# EAGLE design IEC-Breakout (EAGLE 9.6.2)
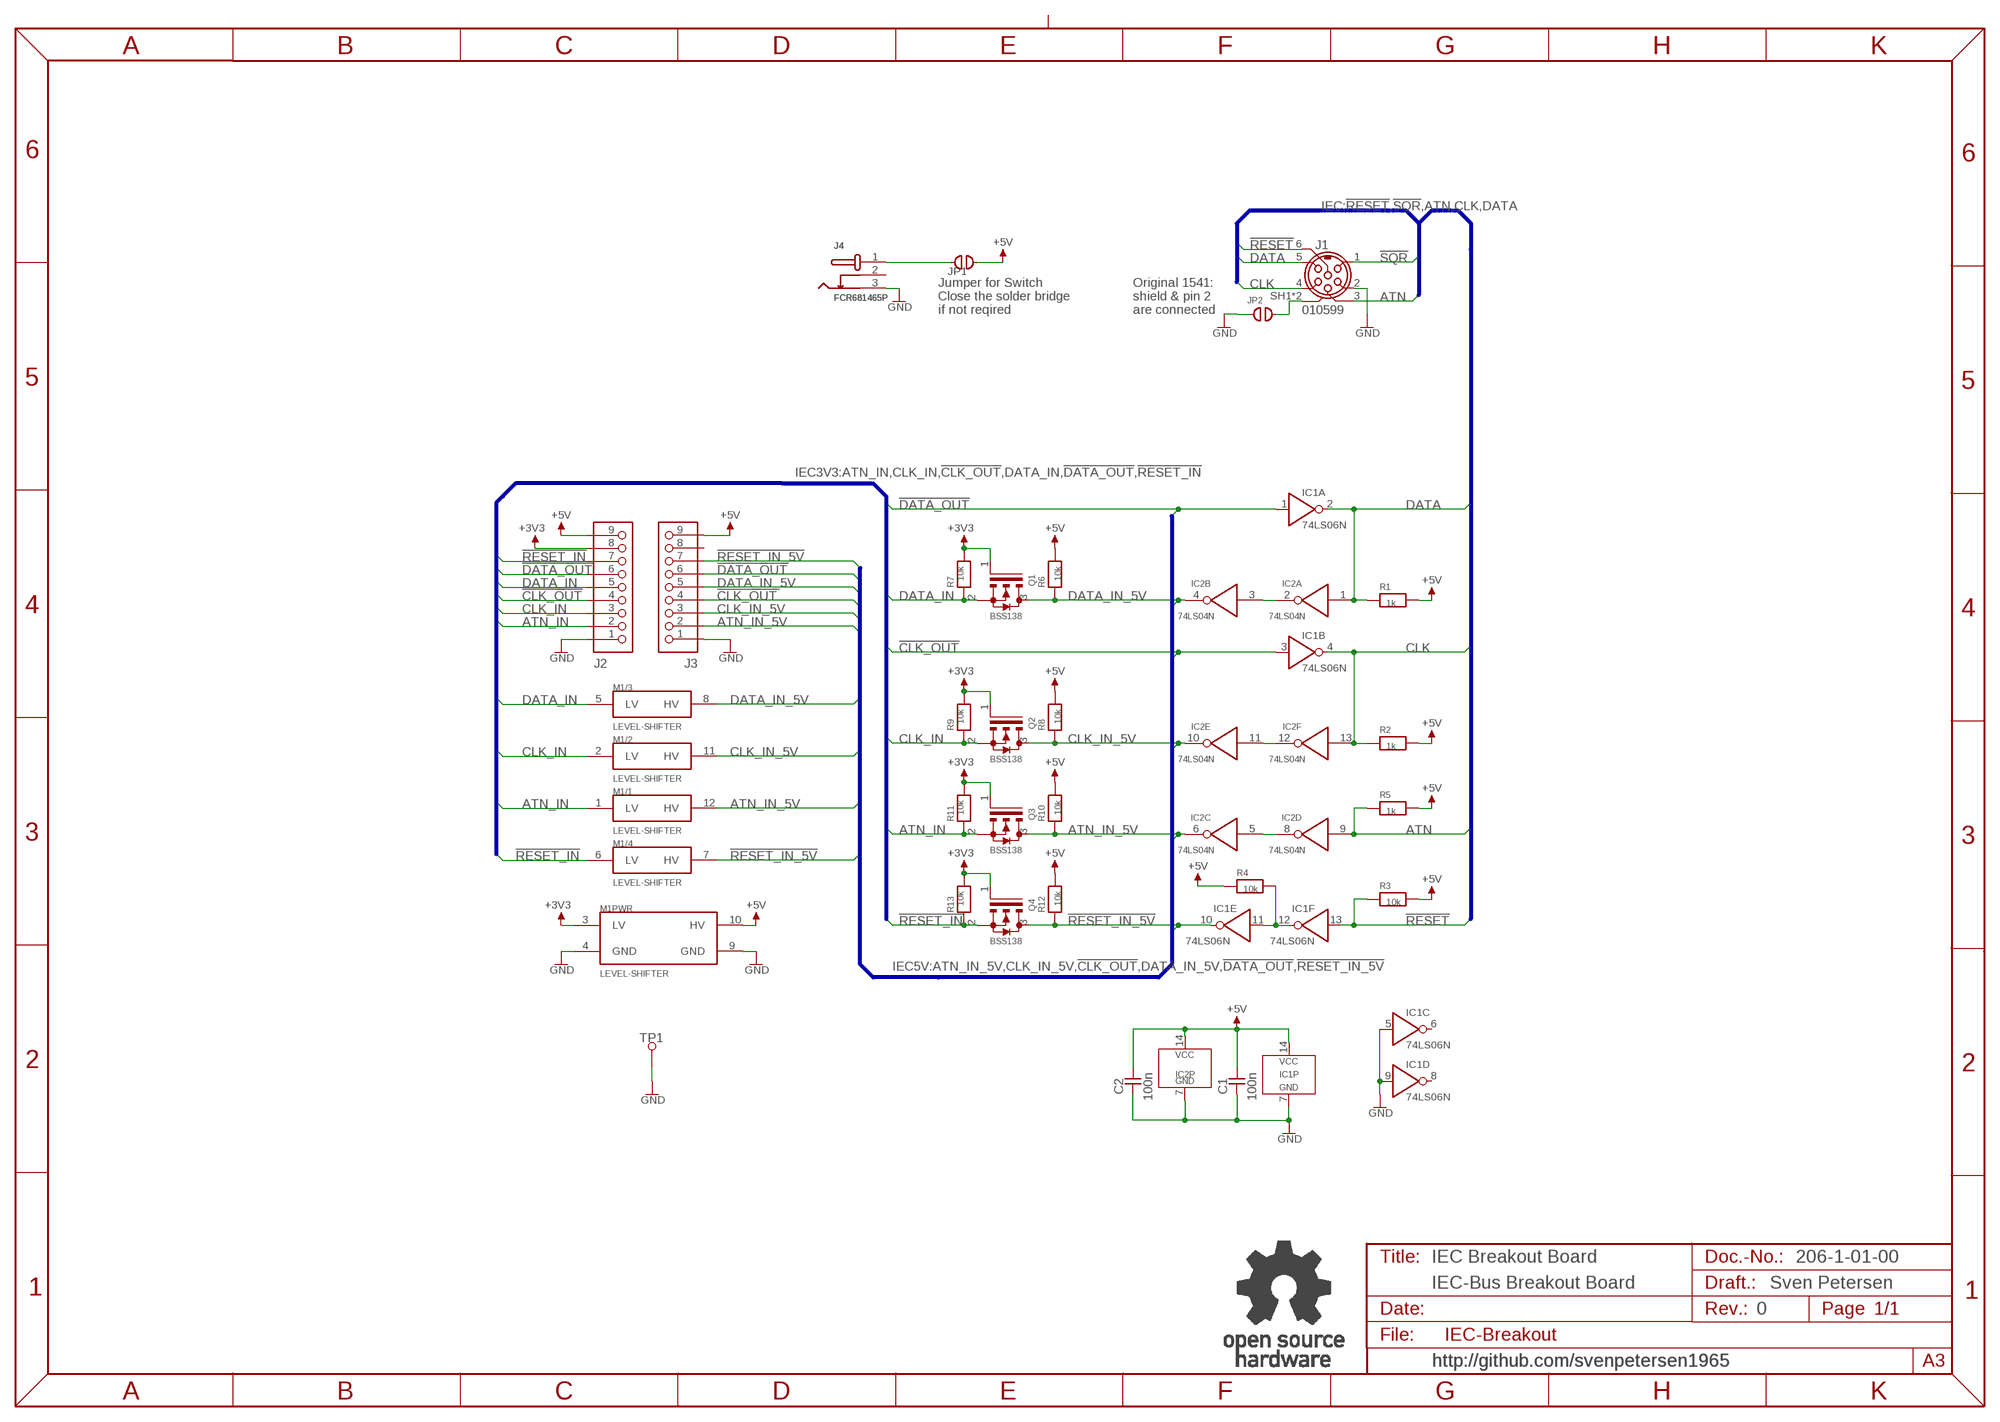
[diagram p0: schematic, sheet 1]

## Parts
C1  100n  CAP01  [C-2,5]
C2  100n  CAP01  [C-2,5]
IC1  74LS06N  7406N  [DIL-14]
IC2  74LS04N  7404N  [DIL-14]
J1  010599  [010599]
J2  PINHD-1X9  [1X09]
J3  PINHD-1X9  [1X09]
J4  FCR681465P  [FCR681465P]
JP1  COMBI_2P  [COMBI-2P]
JP2  OPEN  [CP_OP]
M1  LEVEL-SHIFTER  [L-SHIFTER]
Q1  BSS138  [SOT23]
Q2  BSS138  [SOT23]
Q3  BSS138  [SOT23]
Q4  BSS138  [SOT23]
R1  1k  RES04  [R-10]
R2  1k  RES04  [R-10]
R3  10k  RES04  [R-10]
R4  10k  RES04  [R-10]
R5  1k  RES04  [R-10]
R6  10k  R-0805  [0805]
R7  10k  R-0805  [0805]
R8  10k  R-0805  [0805]
R9  10k  R-0805  [0805]
R10  10k  R-0805  [0805]
R11  10k  R-0805  [0805]
R12  10k  R-0805  [0805]
R13  10k  R-0805  [0805]
TP1  L1,2_R  [1,2MM_R]
U$31  OPEN_SOURCE_HW  [OPENHW]

## Nets
!CLK_OUT: IC1.3(B:I) J2.4 J3.4
!DATA_OUT: IC1.1(A:I) J2.6 J3.6
!RESET: IC1.13(F:I) J1.6 R3.1
!RESET_IN: J2.7 M1.6(/4:LV) Q4.2(S) R13.1
!RESET_IN_5V: IC1.10(E:O) J3.7 M1.7(/4:HV) Q4.3(D) R12.1
!SQR: J1.1
+3V3: J2.8 M1.3(PWR:LV) Q1.1(G) Q2.1(G) Q3.1(G) Q4.1(G) R7.2 R9.2 R11.2 R13.2
+5V: C1.2 C2.2 IC1.14(P:VCC) IC2.14(P:VCC) J2.9 J3.9 JP1.2 M1.10(PWR:HV) R1.2 R2.2 R3.2 R4.1 R5.2 R6.2 R8.2 R10.2 R12.2
ATN: IC2.9(D:I) J1.3 R5.1
ATN_IN: J2.2 M1.1(/1:LV) Q3.2(S) R11.1
ATN_IN_5V: IC2.6(C:O) J3.2 M1.12(/1:HV) Q3.3(D) R10.1
CLK: IC1.4(B:O) IC2.13(F:I) J1.4 R2.1
CLK_IN: J2.3 M1.2(/2:LV) Q2.2(S) R9.1
CLK_IN_5V: IC2.10(E:O) J3.3 M1.11(/2:HV) Q2.3(D) R8.1
DATA: IC1.2(A:O) IC2.1(A:I) J1.5 R1.1
DATA_IN: J2.5 M1.5(/3:LV) Q1.2(S) R7.1
DATA_IN_5V: IC2.4(B:O) J3.5 M1.8(/3:HV) Q1.3(D) R6.1
GND: C1.1 C2.1 IC1.5(C:I) IC1.7(P:GND) IC1.9(D:I) IC2.7(P:GND) J1.2 J2.1 J3.1 J4.3 JP2.1 M1.4(PWR:GND) M1.9(PWR:GND) TP1.1
N$1: J1.SH1(SH) J1.SH2(SH) JP2.2
N$2: IC2.2(A:O) IC2.3(B:I)
N$3: J4.1 JP1.1
N$4: IC2.11(E:I) IC2.12(F:O)
N$5: IC2.5(C:I) IC2.8(D:O)
N$6: IC1.11(E:I) IC1.12(F:O) R4.2
Unconnected: IC1.6(C:O) IC1.8(D:O) J3.8 J4.2

## Buses
IEC:!RESET,!SQR,ATN,CLK,DATA
IEC3V3:ATN_IN,CLK_IN,!CLK_OUT,DATA_IN,!DATA_OUT,!RESET_IN
IEC5V:ATN_IN_5V,CLK_IN_5V,!CLK_OUT,DATA_IN_5V,!DATA_OUT,!RESET_IN_5V

## Notes on the sheet
- Jumper for Switch
  Close the solder bridge
  if not reqired
- Original 1541:
  shield & pin 2 
  are connected
- IEC Breakout Board | 206-1-01-00
- IEC-Bus Breakout Board | Sven Petersen
- 0
- http://github.com/svenpetersen1965 | http://github.com/svenpetersen1965

## Library data of the parts
C1 C2 = DISCRETE:CAP01
IC1 = 74XXsmd:7406
IC2 = 74XX:7404
J1 = Lumberg:010599
J2 J3 = PINHEAD:PINHD-1X9
J4 = Cliff:FCR681465P
JP1 = Cutpad:COMBI_2P
JP2 = Cutpad:OPEN: open Cutpad
M1 = miniModules:LEVEL-SHIFTER
Q1-Q4 = Transistoren:BSS138
R1-R5 = DISCRETE:RES04
R6-R13 = SMD:R-0805
TP1 = Pads:L1,2_R
U$31 = Logo:OPEN_SOURCE_HW

## Board
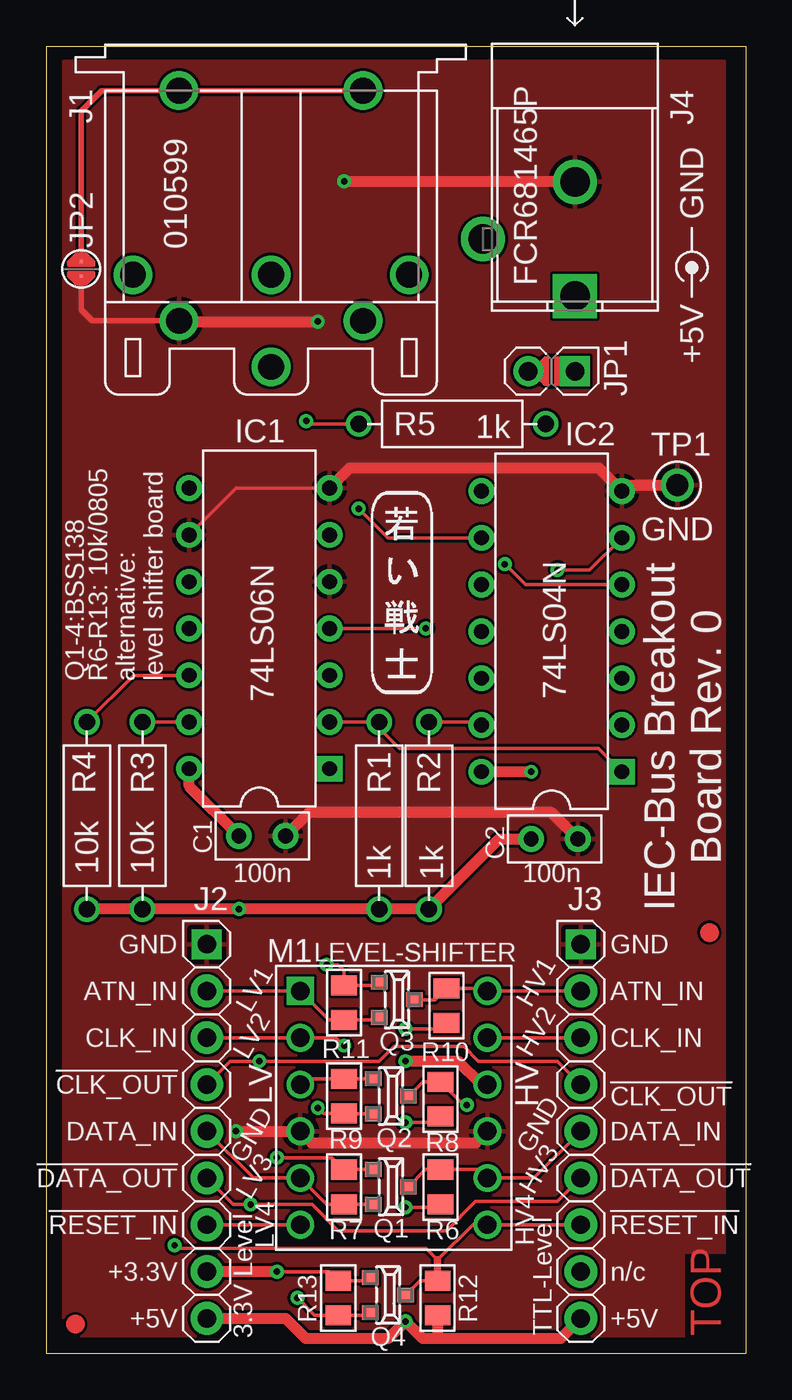
[diagram p1: board, top side]
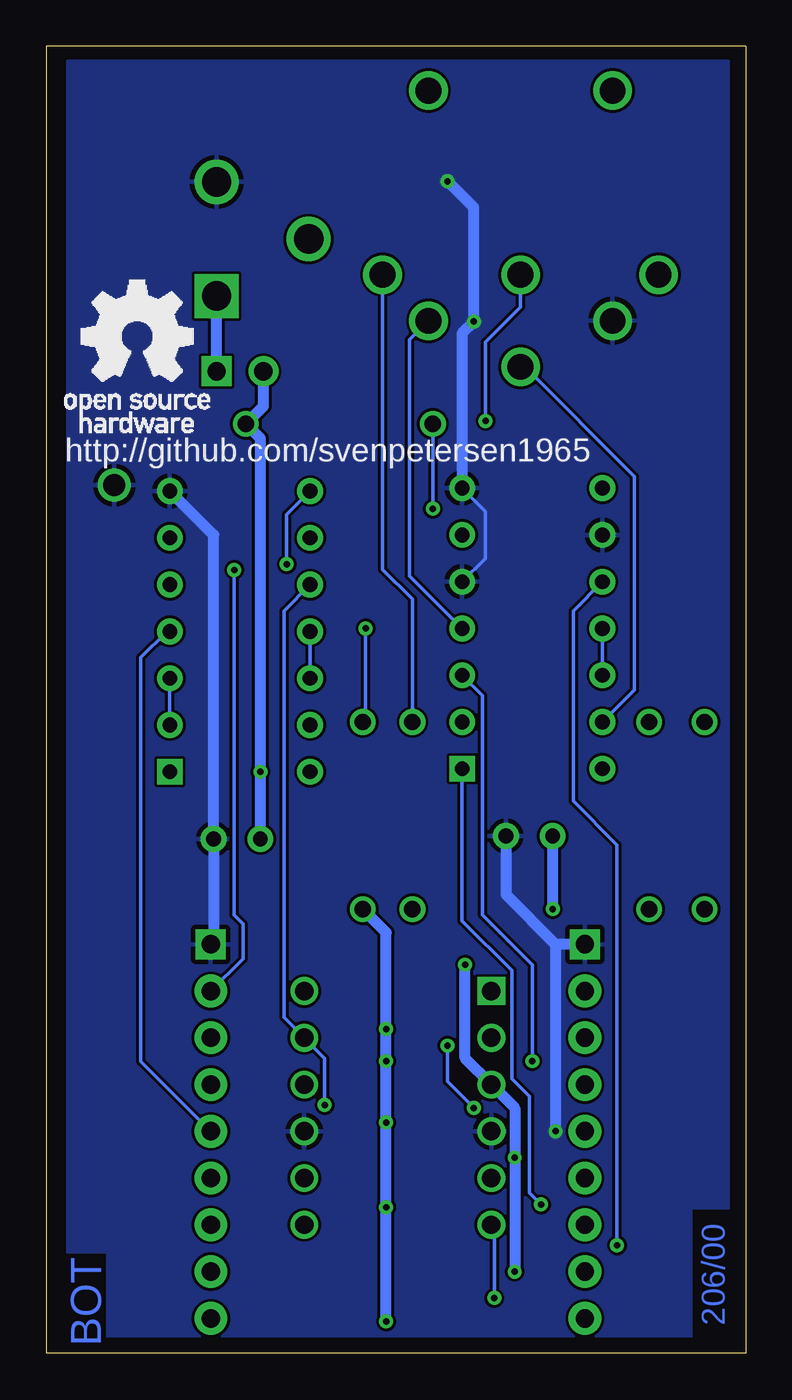
[diagram p2: board, bottom side, seen from below]

Size 38 x 71 mm. Coordinates in mm from the lower left corner, seen from the top.
Outline: 0,0 38,0 38,71 0,71 0,0
Copper layers (1*16): Top 0.035mm / dielectric 1.5mm / Bottom 0.035mm
Design rules "default *": minimum track width 6mil, minimum drill 0.35mm, track to track 6mil, track to pad 6mil, pad to pad 6mil, via to via 6mil, smd to smd 6mil, copper to edge 20mil, drill to drill 6mil, minimum pad ring 10mil, minimum via ring 8mil, stop-mask expansion 4mil, vias tented up to drill 25mil, thermal gap 10mil
bRestrict: 2 lines

### Footprints (pad centres in the part's own frame; a part is rotated, then mirrored left to right if it is on the bottom)
C-2,5 = drill 0.8 pad 1.397: 1 -1.27,0; 2 1.27,0
DIL-14 = drill 0.8 pad 1.397 square: 1 -7.62,-3.81 | drill 0.8 pad 1.397: 2 -5.08,-3.81; 3 -2.54,-3.81; 4 0,-3.81; 5 2.54,-3.81; 6 5.08,-3.81; 7 7.62,-3.81; 8 7.62,3.81; 9 5.08,3.81; 10 2.54,3.81; 11 0,3.81; 12 -2.54,3.81; 13 -5.08,3.81; 14 -7.62,3.81
010599 = drill 1.4: 1 10,-7.5; 2 12.5,-5; 3 10,0; 4 12.5,5; 5 10,7.5; 6 15,0; SH1 0,5; SH2 0,-5
1X09 = drill 1 pad 1.626 square: 1 -10.16,0 | drill 1 pad 1.778: 2 -7.62,0; 3 -5.08,0; 4 -2.54,0; 5 0,0; 6 2.54,0; 7 5.08,0; 8 7.62,0; 9 10.16,0
FCR681465P = drill 1.6 square: 1 0,13.7 | drill 1.6: 2 5,10.6; 3 0,7.5
COMBI-2P = drill 1 pad 1.626 square: 1 -1.27,0 | drill 1 pad 1.626: 2 1.27,0
CP_OP = smd 0.152 x 0.152: 1 -0.4,0; 2 0.4,0
L-SHIFTER = drill 1 square: 1 -5.08,6.35 | drill 1: 2 -5.08,3.81; 3 -5.08,1.27; 4 -5.08,-1.27; 5 -5.08,-3.81; 6 -5.08,-6.35; 7 5.08,-6.35; 8 5.08,-3.81; 9 5.08,-1.27; 10 5.08,1.27; 11 5.08,3.81; 12 5.08,6.35
SOT23 = smd 0.8 x 0.9: 1 -0.953,-0.953; 2 0.953,-0.953; 3 0,0.953
R-10 = drill 0.889 pad 1.397: 1 -5.08,0; 2 5.08,0
0805 = smd 1.092 x 1.397: 1 -0.94,0; 2 0.94,0
1,2MM_R = drill 1.2: 1 0,0

### Placement (x,y rotation side)
C1  11.75,28.1 180 top
C2  27.62,27.94 180 top
IC1  11.59,39.37 90 top
IC2  27.46,39.21 90 top
J1  12.22,68.58 270 top
J2  8.73,12.06 270 top
J3  29.05,12.06 270 top
J4  28.73,71.12 180 top
JP1  27.46,53.34 180 top
JP2  1.91,58.9 90 top
M1  18.89,13.34 0 top
Q1  18.73,9.05 270 top
Q2  18.73,13.97 270 top
Q3  19.05,19.21 270 top
Q4  18.57,3.17 270 top
R1  18.1,29.21 270 top
R2  20.8,29.21 270 top
R3  5.24,29.21 270 top
R4  2.22,29.21 90 top
R5  22.07,50.48 0 top
R6  21.43,9.05 270 top
R7  16.19,9.05 90 top
R8  21.43,13.81 270 top
R9  16.19,13.97 90 top
R10  21.75,18.89 270 top
R11  16.19,19.05 90 top
R12  21.27,3.02 270 top
R13  15.88,3.02 90 top
TP1  34.29,47.15 0 top
U$31  36.99,50.01 0 bottom
U$32  [2LAYER]  36.67,0.95 90 top
U$33  [SMD_REF_R1MM]  1.59,1.59 0 top
U$34  [SMD_REF_R1MM]  36.04,22.86 0 top
U$35  [PCB-TITLE/]  0,76.2 0 top  (outside the outline)
U$36  [SVEN_TAG]  19.37,41.43 0 top

### Tracks (layer width: path | path; a pad name or v marks a point on that pad's centre or on a via)
!CLK_OUT  (via drill 0.35)
  Top 0.203: J2.4 10,15.88 v11.59,15.88 18.1,15.88 18.89,16.67 22.7,16.67 23.5,15.88 27.78,15.88 J3.4
  Bottom 0.203: v11.59,15.88 11.59,21.11 14.29,23.81 14.29,35.72 IC1.3
!DATA_OUT  (via drill 0.35)
  Top 0.203: J2.6 10.16,8.1 v11.11,8.1 14.45,8.1 15.88,6.67 21.75,6.67 23.34,8.26 27.78,8.26 J3.6
  Bottom 0.203: v11.11,8.1 11.75,8.73 11.75,13.97 12.7,14.92 12.7,20.8 15.4,23.5 IC1.1
!RESET
  Top 0.203: R3.1 IC1.13
  Bottom 0.203: IC1.13 6.03,36.04 6.03,47.62 11.99,53.58 J1.6
!RESET_IN  (via drill 0.35)
  Top 0.203: Q4.2 17.48,2.08 R13.1 14.59,2.08 v13.65,3.02 | M1.6 J2.7
  Bottom 0.203: v13.65,3.02 13.65,6.83 M1.6
!RESET_IN_5V  (via drill 0.35)
  Top 0.203: Q4.3 20.31,3.96 R12.1 | J3.7 M1.7 23.18,6.99 21.27,5.08 20.64,5.71 7.14,5.71 v6.99,5.87
  Top 0.406: R12.1 21.27,5.08
  Bottom 0.203: IC1.10 9.37,40.32 9.37,30 6.99,27.62 v6.99,5.87
+3V3  (via drill 0.35)
  Top 0.203: Q3.1 17.93,19.99 R11.2 16.19,20.8 15.88,21.11 v15.24,21.11 | Q2.1 17.77,14.91 R9.2 14.92,14.91 14.12,14.91 M1.3 | Q1.1 16.2,10 R7.2 15.54,10.64 v12.54,10.64 | Q4.1 17.45,3.96 R13.2 15.39,4.45 v12.54,4.45
  Top 0.61: v12.54,4.45 J2.8
  Bottom 0.61: v15.24,21.11 15.24,16.03 M1.3 12.54,13.34 v12.54,10.64 v12.54,4.45
+5V  (via drill 0.35)
  Top 0.203: v19.53,7.94 21.26,7.94 R6.2 | v19.53,12.54 21.1,12.54 R8.2 | v19.53,17.62 21.42,17.62 R10.2
  Top 0.61: J2.9 13.02,1.91 14.11,0.81 18.59,0.81 v19.53,1.75 20.46,0.81 21.27,0.81 | J3.9 27.96,0.81 21.27,0.81 | C2.2 24.61,27.94 R2.2 R1.2 v10.48,24.13 R3.2 R4.1 | M1.10 23.65,14.61 22.38,15.88 v19.53,15.88 | v26.35,31.59 IC2.14 | C1.2 7.78,30.8 IC1.14 | R12.2 21.27,0.81
  Bottom 0.61: R2.2 19.53,22.86 v19.53,17.62 v19.53,15.88 v19.53,12.54 v19.53,7.94 v19.53,1.75 | C2.2 v26.35,31.59 26.35,49.69 R5.2 26.19,51.44 JP1.2 | v10.48,24.13 C1.2
ATN  (via drill 0.35)
  Top 0.203: v16.99,45.88 18.57,44.29 IC2.9 | R5.1 14.29,50.48 v14.13,50.64
  Bottom 0.203: R5.1 v16.99,45.88 | v14.13,50.64 14.13,54.93 12.22,56.83 J1.3
ATN_IN
  Top 0.203: Q3.2 17.95,18.11 R11.1 15.39,18.11 M1.1 J2.2
ATN_IN_5V  (via drill 0.35)
  Top 0.203: Q3.3 21.13,19.21 R10.1 23.82,19.83 M1.12 J3.2 | IC2.6 29.53,42.55 v27.78,42.55
  Bottom 0.203: v27.78,42.55 27.78,23.81 27.3,23.34 27.3,21.43 J3.2
CLK  (via drill 0.35)
  Top 0.203: R2.1 23.5,34.29 IC2.13 | v20.64,39.37 IC1.4
  Bottom 0.203: IC1.4 18.26,42.23 18.26,55.05 J1.4 | R2.1 20.64,34.45 v20.64,39.37
CLK_IN  (via drill 0.35)
  Top 0.203: Q2.2 16.2,13.02 R9.1 15.07,13.03 v14.76,13.34 | J2.3 M1.2 15.76,17.14 v16.19,16.72
  Bottom 0.203: v14.76,13.34 16.19,14.76 v16.19,16.72 | v16.19,16.72 16.19,16.83 v16.19,16.72
CLK_IN_5V  (via drill 0.35)
  Top 0.203: Q2.3 20.47,14.75 R8.1 22.69,13.49 v22.86,13.49 | M1.11 J3.3
  Bottom 0.203: v22.86,13.49 22.86,16.03 M1.11 25.08,18.26 25.08,20.95 25.08,21.59 25.08,40.32 IC2.10
DATA
  Top 0.203: IC1.2 R1.1 18.1,33.97 19.21,32.86 30,32.86 IC2.1
  Bottom 0.203: R1.1 18.1,40.96 19.72,42.58 J1.5
DATA_IN
  Top 0.203: Q1.2 17.77,8.11 R7.1 15.23,8.11 M1.5 11.27,9.53 J2.5
DATA_IN_5V
  Top 0.203: Q1.3 20.62,9.99 R6.1 23.51,9.99 M1.8 26.51,9.53 J3.5
  Bottom 0.203: J3.5 32.86,15.88 32.86,37.78 31.43,39.21 IC2.4
GND  (via drill 0.35)
  Top 0.203: IC1.9 10.32,46.99 IC1.7
  Top 0.305: J1.2 2.5,56.08 1.91,56.67 JP2.1
  Top 0.61: M1.9 23.34,11.43 14.45,11.43 M1.4 v10.32,12.06 | J1.2 7.26,56.04 v14.76,56.04 | IC1.7 16.51,48.1 30,48.1 IC2.7 31.59,47.15 TP1.1 | C2.1 27.46,29.37 14.29,29.37 C1.1 | v16.19,63.66 28.7,63.66 J4.3
  Bottom 0.203: IC1.5 14.13,43.18 14.13,45.72 IC1.7
  Bottom 0.61: IC1.7 15.4,55.4 v14.76,56.04 14.76,62.23 v16.19,63.66 | IC2.7 28.89,44.45 C2.1 28.89,22.38 J3.1 | C1.1 13.02,24.92 10.32,22.23 | 10.32,22.23 v10.32,12.06 | J2.1 10.32,22.23
  pour Top: 0.95,70.17 0.95,0.95 36.83,0.95 36.83,70.17
  pour Bottom: 0.95,70.17 0.95,0.95 36.83,0.95 36.83,70.17
N$1
  Top 0.305: JP2.2 1.91,67.47 3.02,68.58 J1.SH2 J1.SH1
N$2
  Bottom 0.203: IC2.2 IC2.3
N$3
  Bottom 0.61: JP1.1 J4.1
N$4
  Bottom 0.203: IC2.12 IC2.11
N$5  (via drill 0.35)
  Top 0.203: IC2.5 26.04,41.75 v24.92,42.86
  Bottom 0.203: v24.92,42.86 24.92,45.56 IC2.8
N$6
  Top 0.203: R4.2 4.76,36.83 IC1.12
  Bottom 0.203: IC1.12 IC1.11

### Text on the board
Bottom: 206/00
tPlace: GND | +5V
tNames: GND | Q1-4:BSS138 | R6-R13: 10k/0805 | alternative: / level shifter board | IEC-Bus Breakout / Board Rev. 0 | GND | GND | LV1 | ATN_IN | ATN_IN | HV1 | LV2 | CLK_IN | CLK_IN | HV2 | !CLK_OUT | !CLK_OUT | GND | DATA_IN | DATA_IN | GND | !DATA_OUT | LV3 | !DATA_OUT | HV3 | !RESET_IN | LV4 | !RESET_IN | HV4 | +3.3V | n/c | +5V | +5V | 3.3V Level | TTL-Level
bNames: http://github.com/svenpetersen1965
Document: 206-2-01-00 | Sven Petersen / 2023 | 2 | 35µ | 0